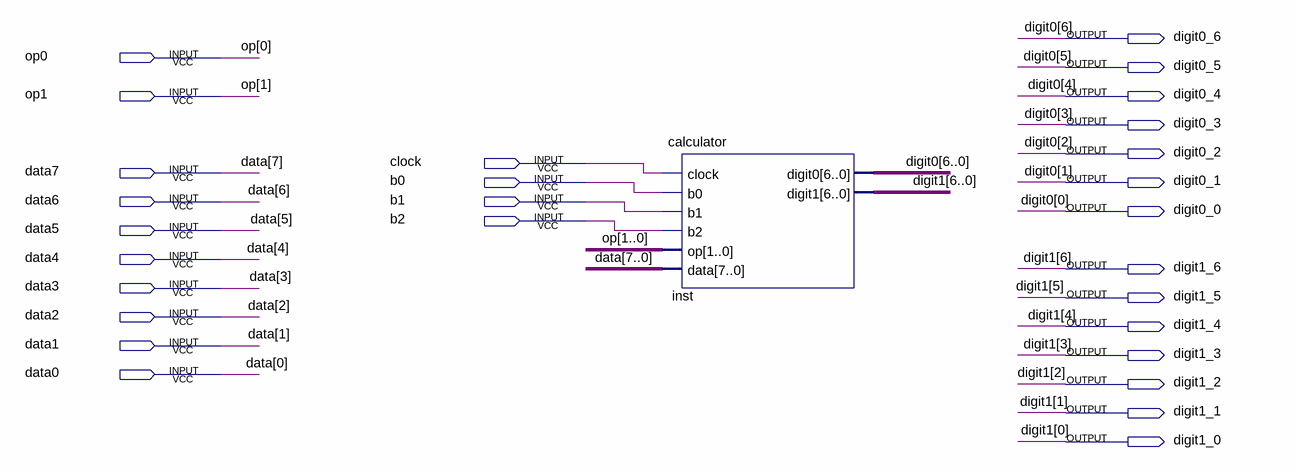
[diagram p0: schematic sheet]
// Quartus schematic calc_circuit.bdf as structural Verilog: 1 symbols, 28 pins
module calc_circuit (
  input  op0,
  input  op1,
  input  clock,
  input  data7,
  input  b0,
  input  data6,
  input  b1,
  input  b2,
  input  data5,
  input  data4,
  input  data3,
  input  data2,
  input  data1,
  input  data0,
  output digit0_6,
  output digit0_5,
  output digit0_4,
  output digit0_3,
  output digit0_2,
  output digit0_1,
  output digit0_0,
  output digit1_6,
  output digit1_5,
  output digit1_4,
  output digit1_3,
  output digit1_2,
  output digit1_1,
  output digit1_0
);

  calculator inst (
    .clock(clock), .b0(b0), .b1(b1), .b2(b2), .op({op1, op0}),
    .data({data7, data6, data5, data4, data3, data2, data1, data0}),
    .digit0({digit0_6, digit0_5, digit0_4, digit0_3, digit0_2, digit0_1, digit0_0}),
    .digit1({digit1_6, digit1_5, digit1_4, digit1_3, digit1_2, digit1_1, digit1_0}));

  // Other names for the same wires on the sheet: digit0[6:0] = {digit0_6, digit0_5, digit0_4, digit0_3, digit0_2, digit0_1, digit0_0};
  //   digit1[6:0] = {digit1_6, digit1_5, digit1_4, digit1_3, digit1_2, digit1_1, digit1_0}
endmodule
